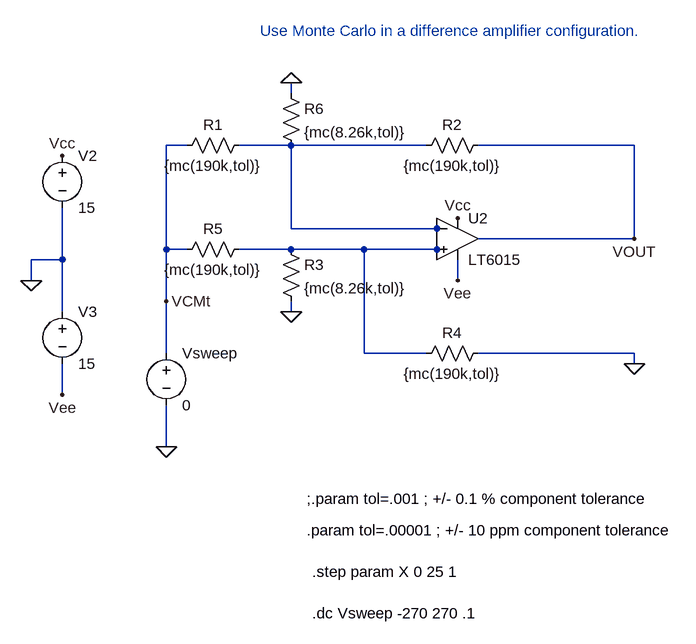
[diagram p0: schematic CMRR6375.asc]
CMRR6375.asc, the LTspice schematic file:
Version 4
SHEET 1 1072 680
WIRE -1568 -544 -1568 -560
WIRE -1728 -464 -1760 -464
WIRE -1568 -464 -1648 -464
WIRE -1360 -464 -1568 -464
WIRE -1040 -464 -1280 -464
WIRE -1568 -336 -1568 -464
WIRE -1344 -336 -1568 -336
WIRE -1328 -336 -1344 -336
WIRE -1040 -320 -1040 -464
WIRE -1040 -320 -1280 -320
WIRE -1760 -304 -1760 -464
WIRE -1728 -304 -1760 -304
WIRE -1568 -304 -1648 -304
WIRE -1456 -304 -1568 -304
WIRE -1344 -304 -1456 -304
WIRE -1328 -304 -1344 -304
WIRE -1920 -288 -1920 -368
WIRE -1920 -288 -1968 -288
WIRE -1968 -256 -1968 -288
WIRE -1312 -256 -1312 -288
WIRE -1760 -224 -1760 -304
WIRE -1920 -208 -1920 -288
WIRE -1568 -208 -1568 -224
WIRE -1760 -144 -1760 -224
WIRE -1456 -144 -1456 -304
WIRE -1360 -144 -1456 -144
WIRE -1040 -144 -1280 -144
WIRE -1040 -128 -1040 -144
WIRE -1920 -80 -1920 -128
WIRE -1760 0 -1760 -64
FLAG -1968 -256 0
FLAG -1920 -448 Vcc
FLAG -1312 -352 Vcc
FLAG -1920 -80 Vee
FLAG -1312 -256 Vee
FLAG -1760 -224 VCMt
FLAG -1040 -320 VOUT
FLAG -1568 -208 0
FLAG -1568 -560 0
FLAG -1040 -128 0
FLAG -1760 0 0
SYMBOL voltage -1920 -464 R0
WINDOW 123 0 0 Left 2
WINDOW 39 0 0 Left 2
SYMATTR InstName V2
SYMATTR Value 15
SYMBOL voltage -1920 -224 R0
WINDOW 123 0 0 Left 2
WINDOW 39 0 0 Left 2
SYMATTR InstName V3
SYMATTR Value 15
SYMBOL res -1264 -480 R90
WINDOW 0 0 56 VBottom 2
WINDOW 3 32 56 VTop 2
SYMATTR InstName R2
SYMATTR Value {mc(190k,tol)}
SYMBOL res -1632 -480 R90
WINDOW 0 0 56 VBottom 2
WINDOW 3 32 56 VTop 2
SYMATTR InstName R1
SYMATTR Value {mc(190k,tol)}
SYMBOL res -1376 -128 R270
WINDOW 0 32 56 VTop 2
WINDOW 3 0 56 VBottom 2
SYMATTR InstName R4
SYMATTR Value {mc(190k,tol)}
SYMBOL res -1632 -320 R90
WINDOW 0 0 56 VBottom 2
WINDOW 3 32 56 VTop 2
SYMATTR InstName R5
SYMATTR Value {mc(190k,tol)}
SYMBOL Opamps\\LT6015 -1312 -320 R0
SYMATTR InstName U2
SYMBOL res -1584 -320 R0
SYMATTR InstName R3
SYMATTR Value {mc(8.26k,tol)}
SYMBOL res -1584 -560 R0
SYMATTR InstName R6
SYMATTR Value {mc(8.26k,tol)}
SYMBOL voltage -1760 -160 R0
WINDOW 123 0 0 Left 2
WINDOW 39 0 0 Left 2
SYMATTR InstName Vsweep
SYMATTR Value 0
TEXT -1536 192 Left 2 !.step param X 0 25 1
TEXT -1544 128 Left 2 !.param tol=.00001 ; +/- 10 ppm component tolerance
TEXT -1616 -640 Left 2 ;Use Monte Carlo in a difference amplifier configuration.
TEXT -1544 80 Left 2 !;.param tol=.001 ; +/- 0.1 % component tolerance
TEXT -1536 256 Left 2 !.dc Vsweep -270 270 .1

The netlist it stands for:
* CMRR6375.asc
V2 Vcc 0 15
V3 0 Vee 15
R2 VOUT N001 {mc(190k,tol)}
R1 N001 VCMt {mc(190k,tol)}
R4 N002 0 {mc(190k,tol)}
R5 N002 VCMt {mc(190k,tol)}
XU2 N002 N001 Vcc Vee VOUT LT6016  ; LT6015, pins In+ In- V+ V- OUT
R3 N002 0 {mc(8.26k,tol)}
R6 0 N001 {mc(8.26k,tol)}
Vsweep VCMt 0 0
.step param X 0 25 1
.param tol=.00001 ; +/- 10 ppm component tolerance
* Use Monte Carlo in a difference amplifier configuration.
;.param tol=.001 ; +/- 0.1 % component tolerance
.dc Vsweep -270 270 .1
.lib LTC2.lib
.backanno
.end